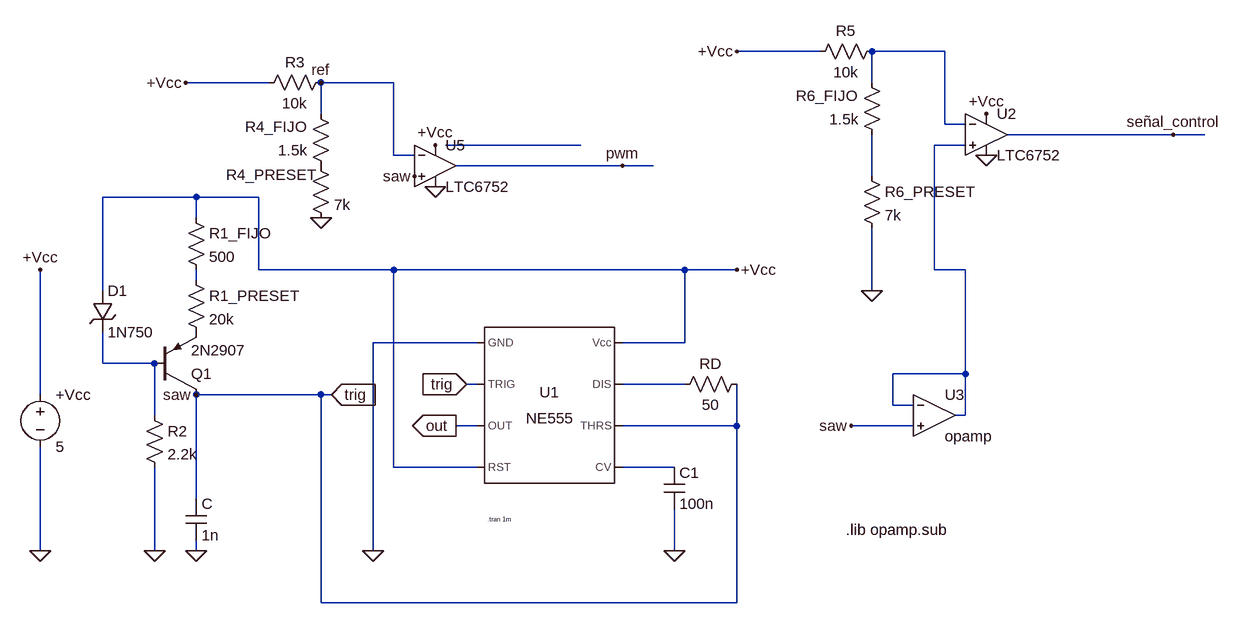
[diagram p0: schematic simulacion_Ex1.asc]
simulacion_Ex1.asc, the LTspice schematic file:
Version 4
SHEET 1 1352 680
WIRE 240 -272 112 -272
WIRE 432 -272 320 -272
WIRE -608 -224 -736 -224
WIRE -416 -224 -528 -224
WIRE 320 -224 320 -272
WIRE -528 -176 -528 -224
WIRE 432 -160 432 -272
WIRE 464 -160 432 -160
WIRE 784 -144 528 -144
WIRE 832 -144 784 -144
WIRE -128 -128 -336 -128
WIRE 464 -128 416 -128
WIRE -416 -112 -416 -224
WIRE -384 -112 -416 -112
WIRE -64 -96 -320 -96
WIRE -16 -96 -64 -96
WIRE 320 -80 320 -144
WIRE -720 -48 -864 -48
WIRE -624 -48 -720 -48
WIRE -720 -16 -720 -48
WIRE -624 64 -624 -48
WIRE -416 64 -624 64
WIRE 32 64 -416 64
WIRE 112 64 32 64
WIRE 416 64 416 -128
WIRE 464 64 416 64
WIRE -720 80 -720 64
WIRE -864 96 -864 -48
WIRE 320 96 320 0
WIRE -288 176 -448 176
WIRE 32 176 32 64
WIRE 32 176 -64 176
WIRE -864 208 -864 160
WIRE -784 208 -864 208
WIRE 464 224 464 64
WIRE 464 224 352 224
WIRE -288 240 -304 240
WIRE 32 240 -64 240
WIRE -960 256 -960 64
WIRE -528 256 -720 256
WIRE -512 256 -528 256
WIRE 352 272 352 224
WIRE 384 272 352 272
WIRE -784 288 -784 208
WIRE 464 288 464 224
WIRE 464 288 448 288
WIRE -288 304 -320 304
WIRE 112 304 112 240
WIRE 112 304 -64 304
WIRE 384 304 288 304
WIRE -416 368 -416 64
WIRE -288 368 -416 368
WIRE 16 368 -64 368
WIRE -720 416 -720 256
WIRE -960 496 -960 336
WIRE -784 496 -784 368
WIRE -720 496 -720 480
WIRE -448 496 -448 176
WIRE 16 496 16 432
WIRE -528 576 -528 256
WIRE 112 576 112 304
WIRE 112 576 -528 576
FLAG -448 496 0
FLAG 16 496 0
FLAG -960 496 0
FLAG -320 304 out
IOPIN -320 304 Out
FLAG -304 240 trig
IOPIN -304 240 In
FLAG -720 496 0
FLAG -784 496 0
FLAG -512 256 trig
IOPIN -512 256 In
FLAG -352 -128 +Vcc
FLAG -720 256 saw
FLAG -528 -16 0
FLAG -960 64 +Vcc
FLAG 112 64 +Vcc
FLAG -736 -224 +Vcc
FLAG -384 -80 saw
FLAG -352 -64 0
FLAG -528 -224 ref
FLAG -64 -96 pwm
FLAG 496 -176 +Vcc
FLAG 320 96 0
FLAG 112 -272 +Vcc
FLAG 496 -112 0
FLAG 784 -144 señal_control
FLAG 288 304 saw
SYMBOL Misc\\NE555 -176 272 R0
SYMATTR InstName U1
SYMBOL cap 0 368 R0
SYMATTR InstName C1
SYMATTR Value 100n
SYMBOL pnp -784 256 M180
SYMATTR InstName Q1
SYMATTR Value 2N2907
SYMBOL res -800 272 R0
SYMATTR InstName R2
SYMATTR Value 2.2k
SYMATTR SpiceLine tol=1 pwr=0.1
SYMBOL res -736 64 R0
SYMATTR InstName R1_PRESET
SYMATTR Value 20k
SYMATTR SpiceLine tol=1 pwr=0.1
SYMBOL cap -736 416 R0
SYMATTR InstName C
SYMATTR Value 1n
SYMBOL voltage -960 240 R0
WINDOW 123 0 0 Left 0
WINDOW 39 0 0 Left 0
SYMATTR InstName +Vcc
SYMATTR Value 5
SYMBOL res -512 -240 R90
WINDOW 0 0 56 VBottom 2
WINDOW 3 32 56 VTop 2
SYMATTR InstName R3
SYMATTR Value 10k
SYMBOL res -512 -80 R180
WINDOW 0 36 76 Left 2
WINDOW 3 36 40 Left 2
SYMATTR InstName R4_FIJO
SYMATTR Value 1.5k
SYMBOL res 128 224 R90
WINDOW 0 0 56 VBottom 2
WINDOW 3 32 56 VTop 2
SYMATTR InstName RD
SYMATTR Value 50
SYMBOL Comparators\\LTC6752 -352 -160 R0
SYMATTR InstName U5
SYMBOL zener -880 96 R0
SYMATTR InstName D1
SYMATTR Value 1N750
SYMBOL res -544 -112 R0
WINDOW 0 -130 30 Left 2
SYMATTR InstName R4_PRESET
SYMATTR Value 7k
SYMBOL res -736 -32 R0
SYMATTR InstName R1_FIJO
SYMATTR Value 500
SYMBOL res 336 -288 R90
WINDOW 0 0 56 VBottom 2
WINDOW 3 32 56 VTop 2
SYMATTR InstName R5
SYMATTR Value 10k
SYMBOL res 336 -128 R180
WINDOW 0 36 76 Left 2
WINDOW 3 36 40 Left 2
SYMATTR InstName R6_FIJO
SYMATTR Value 1.5k
SYMBOL Comparators\\LTC6752 496 -208 R0
SYMATTR InstName U2
SYMBOL res 304 -96 R0
SYMATTR InstName R6_PRESET
SYMATTR Value 7k
SYMBOL Opamps\\opamp 416 224 R0
SYMATTR InstName U3
TEXT -272 448 Left 0 !.tran 1m
TEXT 280 464 Left 2 !.lib opamp.sub

The netlist it stands for:
* simulacion_Ex1.asc
XU1 0 saw out +Vcc N008 saw N007 +Vcc NE555  ; pins GND TRIG OUT RST CV THRS DIS Vcc
C1 N008 0 100n
Q1 saw N006 P001 0 2N2907
R2 N006 0 2.2k tol=1 pwr=0.1
R1_PRESET N005 P001 20k tol=1 pwr=0.1
C saw 0 1n
V§+Vcc +Vcc 0 5
R3 ref +Vcc 10k
R4_FIJO P002 ref 1.5k
RD saw N007 50
XU5 saw ref +Vcc 0 pwm LTC6752  ; pins In+ In- V+ V- OUT
D1 +Vcc N006 1N750
R4_PRESET P002 0 7k
R1_FIJO +Vcc N005 500
R5 N001 +Vcc 10k
R6_FIJO N004 N001 1.5k
XU2 N003 N001 +Vcc 0 señal_control LTC6752  ; pins In+ In- V+ V- OUT
R6_PRESET N004 0 7k
XU3 N003 saw N003 opamp Aol=100K GBW=10Meg  ; pins invin noninvin out
.model D D
.lib standard.dio
.model NPN NPN
.model PNP PNP
.lib standard.bjt
.tran 1m
.lib opamp.sub
.lib NE555.sub
.lib LTC7.lib
.backanno
.end